# Altium schematic sheet dropout_timer.SchDoc
size A; SheetNumber: 2; SheetTotal: 2
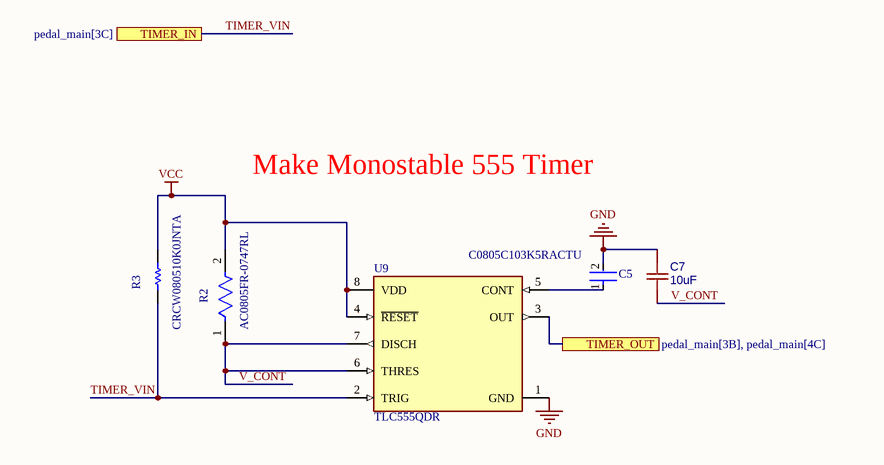
[diagram p0: dropout_timer.SchDoc]

## Parts
C5  C0805C103K5RACTU  [FP-C0805C-DN-MFG]
C7  10uF  [C0603]
R2  AC0805FR-0747RL  [FP-AC0805-MFG]
R3  CRCW080510K0JNTA  [RESC2013X50X30LL20T20]
U9  TLC555QDR  [FP-D0008A-IPC_C]

## Ports
TIMER_IN (see pedal_main[3C]), TIMER_OUT (see pedal_main[3B], pedal_main[4C])

## Nets
GND: C5.2 C7.2 U9.1(GND)
VCC: R2.2 R3.2 U9.4(~{RESET}) U9.8(VDD)
TIMER_OUT: U9.3(OUT) ; port TIMER_OUT
TIMER_VIN: R3.1 U9.2(TRIG) ; port TIMER_IN
V_CONT: C7.1 R2.1 U9.6(THRES) U9.7(DISCH)
NetC5_1: C5.1 U9.5(CONT)

## Notes on the sheet
- Make Monostable 555 Timer

## Library data of the parts
C5 = CMP-2007-01079-2: CAP CER 10000PF 50V X7R 0805; Manufacturer: KEMET; Capacitance: 10,000 pF; Material: Ceramic; Description: C0805 10,000 pF X7R 30ppm/°C 10.00% 50 V; Tolerance: 0.1; Value: 10,000 pF; Temperature Coefficient: 30ppm/°C; Temperature: -55°C to +125°C; Device Class L3: Ceramic Capacitors; ComponentLink2URL: https://content.kemet.com/datasheets/KEM_C1003_C0G_SMD.pdf; Temperature Range Low: -55°C; Manufacturer Part Number: C0805C103K5RACTU; Ipc Land Pattern Name: CAPC200125X78; Height: 0.88mm; Temperature Range High: +125°C; Category: Cap; ComponentLink2Description: Datasheet; Octopart: https://octopart.com/c0805c103k5ractu-kemet-90536; Package: C0805C-DN; Device Class L2: Capacitors; Voltage Rating: 50 V; RoHS: TRUE; Automotive: No; Digikey Description: CAP CER 10000PF 50V X7R 0805; Temperature Characteristic: X7R; Device Class L1: Passive Components; Lead Free: Yes
C7 = CAP_0603: Symbol: CAP_OLD; ConvertToPcb: yes; ModelId: 624118aa3cc7497086c383c2d72e0852ÂŽ0819f05c4eef4c71ace90d822a990e87; ModelName: C0603_L1.6-W0.8-H0.8; ModelTransform: 62.992,31.496,0,0,0,0,0,0,0; Device: CAP_0603; Value: 10uF; AddInBom: yes; Supplier Footprint: 0603; FootprintName: C0603
R2 = CMP-03412-037772-1: RES SMD 47 OHM 1% 1/8W 0805; Manufacturer: Yageo; Resistance: 47Ω; Value: 47Ω; Voltage Rating: 150V; Tolerance: 0.01; Automotive Grade: Grade 0; Category: Res; Digikey Description: RES SMD 47 OHM 1% 1/8W 0805; Mouser Description: Thick Film Resistors - SMD 1/8W 47ohm 1% AEC-Q200; Temperature: -55°C to +155°C; Temperature Range Low: -55°C; Temperature Range High: +155°C; Device Class L2: Resistors; Composition: Thick Film; Package: AC0805; Lead Free: Yes; ComponentLink2URL: http://www.yageo.com/documents/recent/PYu-AC_51_RoHS_L_6.pdf; Automotive: Yes; Device Class L3: Chip SMD Resistors; Octopart: https://octopart.com/ac0805fr-0747rl-yageo-46503502; ComponentLink2Description: Datasheet; Power Rating: 1/8W; Height: 0.6mm; Ipc Land Pattern Name: RESC200125X50; RoHS: TRUE; Device Class L1: Passive Components; Footprint Url: http://www.yageo.com/exep/pages/download/literatures/PYu-R_Mount_10.pdf; Series: AC; Manufacturer Part Number: AC0805FR-0747RL
R3 = CMP-2001-04257-1: Manufacturer: Vishay Dale; Part Number: CRCW080510K0JNTA
U9 = CMP-04858-000019-1: IC OSC SGL TIMER 2.1MHZ 8-SOIC; Operating Supply Current: 360uA; Quiescent Current: 250uA; Min Supply Voltage: 5V; Max Power Dissipation: 725mW; Number of Timers/Counters: 1; Low Level Output Current: 100mA; High Level Output Current: -10mA; Max Supply Voltage: 15V; Frequency: 2.1MHz; Radiation Hardening: No; Contact Plating: Gold; Height: 1.58mm; Max Operating Temperature: 125°C; Package Quantity: 2500; Length: 4.9mm; Width: 3.91mm; Min Operating Temperature: -40°C; Mount: Surface Mount; Lead Free: Lead Free; Number of Pins: 8; Weight: 0.002677oz; Packaging: Tape and Reel; REACH SVHC: No SVHC; Case/Package: SOIC; Nominal Supply Current: 250uA; RoHS Compliant: Yes; Power Dissipation: 725mW